# Altium project SAMA7D65-Curiosity.PrjPcb (part 11 of 12)

## Sheet 15 - LED-User-Debug.SchDoc
size B; CompanyName: Microchip Technology Inc.; Organization: Microchip Technology; Address1: 2355 West Chandler Blvd.; Address2: Chandler, AZ  85224; Address4: USA; DocumentNumber: 15; SheetNumber: 15; SheetTotal: 15; SheetTitle: User, Debug Interfaces
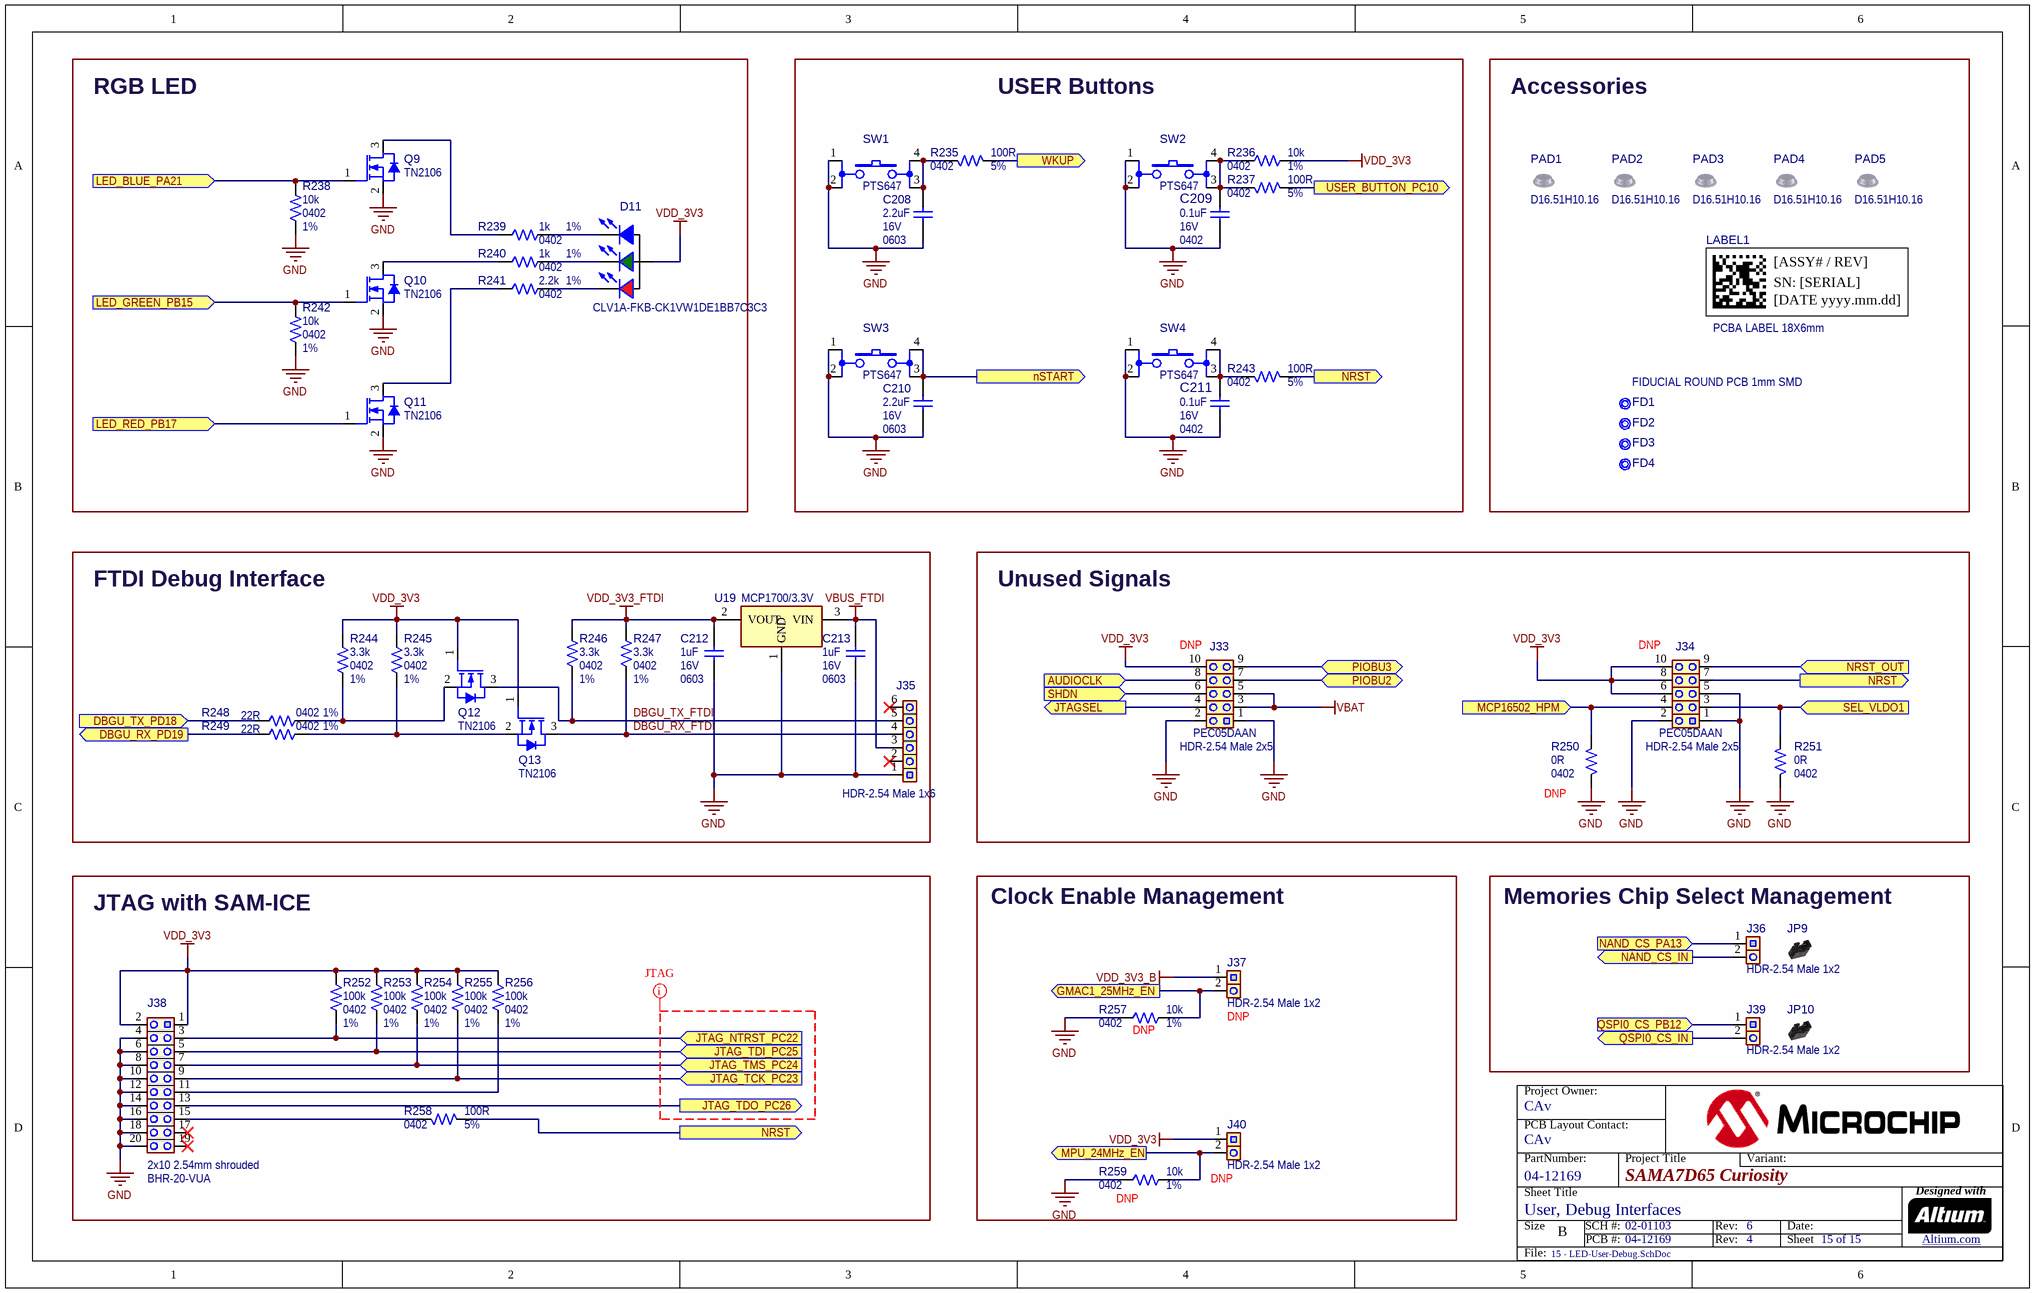
[diagram p14: 15 - LED-User-Debug.SchDoc]

### Parts
C208  value 2.2uF  Voltage: 16V  Package: 0603  [CAP_C_0603]  (hidden comment: Capacitor NP)
C209  value 0.1uF  Voltage: 16V  Package: 0402  [CAP_C_0402]  (hidden comment: Capacitor NP)
C210  value 2.2uF  Voltage: 16V  Package: 0603  [CAP_C_0603]  (hidden comment: Capacitor NP)
C211  value 0.1uF  Voltage: 16V  Package: 0402  [CAP_C_0402]  (hidden comment: Capacitor NP)
C212  value 1uF  Voltage: 16V  Package: 0603  [CAP_C_0603]  (hidden comment: Capacitor NP)
C213  value 1uF  Voltage: 16V  Package: 0603  [CAP_C_0603]  (hidden comment: Capacitor NP)
D11  Manufacturer Part Number 1: CLV1A-FKB-CK1VW1DE1BB7C3C3  [PLCC-4_CLV1A-FKB]  (hidden comment: LED_RGB_CLV1A)
FD1  Description_: FIDUCIAL ROUND PCB 1mm SMD  [Fiducial_1mm]  (hidden comment: FIDUCIAL ROUND)  (no BOM)
FD2  FIDUCIAL ROUND  [Fiducial_1mm]  (value not drawn)  (no BOM)
FD3  FIDUCIAL ROUND  [Fiducial_1mm]  (value not drawn)  (no BOM)
FD4  FIDUCIAL ROUND  [Fiducial_1mm]  (value not drawn)  (no BOM)
J33  value HDR-2.54 Male 2x5  Manufacturer Part Number 1: PEC05DAAN  Populated: DNP  [HDR_M_2.54_2x5]  (hidden comment: Header 2x5)
J34  value HDR-2.54 Male 2x5  Manufacturer Part Number 1: PEC05DAAN  Populated: DNP  [HDR_M_2.54_2x5]  (hidden comment: Header 2x5)
J35  value HDR-2.54 Male 1x6  [HDR_M_2.54_1x6]  (hidden comment: Header 1x6)
J36  value HDR-2.54 Male 1x2  [HDR_M_2.54_1x2]  (hidden comment: Header 1x2)
J37  value HDR-2.54 Male 1x2  Populated: DNP  [HDR_M_2.54_1x2]  (hidden comment: Header 1x2)
J38  value 2x10 2.54mm shrouded  Manufacturer Part Number 1: BHR-20-VUA  [HDR_M_2.54_2X10_SBH11-PBPC-D10-ST-BK]  (hidden comment: Header 2x10)
J39  value HDR-2.54 Male 1x2  [HDR_M_2.54_1x2]  (hidden comment: Header 1x2)
J40  value HDR-2.54 Male 1x2  Populated: DNP  [HDR_M_2.54_1x2]  (hidden comment: Header 1x2)
JP9  Jumper Mechanical  [Jumper_Mechanical]  (value not drawn)  (mechanical)
JP10  Jumper Mechanical  [Jumper_Mechanical]  (value not drawn)  (mechanical)
LABEL1  value PCBA LABEL 18X6mm  [08-10015]  (hidden comment: 08-10015)
PAD1  value D16.51H10.16  [BUMP_BUMPERSPECIALTIES_BS11BL04X08RP_CYLINDRICAL_BLACK_D16.51H10.16]  (hidden comment: Rubber Pad Cylindrical Taper)
PAD2  value D16.51H10.16  [BUMP_BUMPERSPECIALTIES_BS11BL04X08RP_CYLINDRICAL_BLACK_D16.51H10.16]  (hidden comment: Rubber Pad Cylindrical Taper)
PAD3  value D16.51H10.16  [BUMP_BUMPERSPECIALTIES_BS11BL04X08RP_CYLINDRICAL_BLACK_D16.51H10.16]  (hidden comment: Rubber Pad Cylindrical Taper)
PAD4  value D16.51H10.16  [BUMP_BUMPERSPECIALTIES_BS11BL04X08RP_CYLINDRICAL_BLACK_D16.51H10.16]  (hidden comment: Rubber Pad Cylindrical Taper)
PAD5  value D16.51H10.16  [BUMP_BUMPERSPECIALTIES_BS11BL04X08RP_CYLINDRICAL_BLACK_D16.51H10.16]  (hidden comment: Rubber Pad Cylindrical Taper)
Q9  value TN2106  [SOT-23-3]  (hidden comment: Transistor MOS-N GSD)
Q10  value TN2106  [SOT-23-3]  (hidden comment: Transistor MOS-N GSD)
Q11  value TN2106  [SOT-23-3]  (hidden comment: Transistor MOS-N GSD)
Q12  value TN2106  [SOT-23-3]  (hidden comment: Transistor MOS-N GSD)
Q13  value TN2106  [SOT-23-3]  (hidden comment: Transistor MOS-N GSD)
R235  value 100R  Package: 0402  Tolerance: 5%  [RES_C_0402]  (hidden comment: Resistor)
R236  value 10k  Package: 0402  Tolerance: 1%  [RES_C_0402]  (hidden comment: Resistor)
R237  value 100R  Package: 0402  Tolerance: 5%  [RES_C_0402]  (hidden comment: Resistor)
R238  value 10k  Package: 0402  Tolerance: 1%  [RES_C_0402]  (hidden comment: Resistor)
R239  value 1k  Package: 0402  Tolerance: 1%  [RES_C_0402]  (hidden comment: Resistor)
R240  value 1k  Package: 0402  Tolerance: 1%  [RES_C_0402]  (hidden comment: Resistor)
R241  value 2.2k  Package: 0402  Tolerance: 1%  [RES_C_0402]  (hidden comment: Resistor)
R242  value 10k  Package: 0402  Tolerance: 1%  [RES_C_0402]  (hidden comment: Resistor)
R243  value 100R  Package: 0402  Tolerance: 5%  [RES_C_0402]  (hidden comment: Resistor)
R244  value 3.3k  Package: 0402  Tolerance: 1%  [RES_C_0402]  (hidden comment: Resistor)
R245  value 3.3k  Package: 0402  Tolerance: 1%  [RES_C_0402]  (hidden comment: Resistor)
R246  value 3.3k  Package: 0402  Tolerance: 1%  [RES_C_0402]  (hidden comment: Resistor)
R247  value 3.3k  Package: 0402  Tolerance: 1%  [RES_C_0402]  (hidden comment: Resistor)
R248  value 22R  Package: 0402  Tolerance: 1%  [RES_C_0402]  (hidden comment: Resistor)
R249  value 22R  Package: 0402  Tolerance: 1%  [RES_C_0402]  (hidden comment: Resistor)
R250  value 0R  Package: 0402  Populated: DNP  [RES_C_0402]  (hidden comment: Resistor)
R251  value 0R  Package: 0402  [RES_C_0402]  (hidden comment: Resistor)
R252  value 100k  Package: 0402  Tolerance: 1%  [RES_C_0402]  (hidden comment: Resistor)
R253  value 100k  Package: 0402  Tolerance: 1%  [RES_C_0402]  (hidden comment: Resistor)
R254  value 100k  Package: 0402  Tolerance: 1%  [RES_C_0402]  (hidden comment: Resistor)
R255  value 100k  Package: 0402  Tolerance: 1%  [RES_C_0402]  (hidden comment: Resistor)
R256  value 100k  Package: 0402  Tolerance: 1%  [RES_C_0402]  (hidden comment: Resistor)
R257  value 10k  Package: 0402  Tolerance: 1%  Populated: DNP  [RES_C_0402]  (hidden comment: Resistor)
R258  value 100R  Package: 0402  Tolerance: 5%  [RES_C_0402]  (hidden comment: Resistor)
R259  value 10k  Package: 0402  Tolerance: 1%  Populated: DNP  [RES_C_0402]  (hidden comment: Resistor)
SW1  value PTS647  [SW_SMD_4.5mmX4.5mm_PTS647]  (hidden comment: Switch 4 Pin)
SW2  value PTS647  [SW_SMD_4.5mmX4.5mm_PTS647]  (hidden comment: Switch 4 Pin)
SW3  value PTS647  [SW_SMD_4.5mmX4.5mm_PTS647]  (hidden comment: Switch 4 Pin)
SW4  value PTS647  [SW_SMD_4.5mmX4.5mm_PTS647]  (hidden comment: Switch 4 Pin)
U19  value MCP1700/3.3V  [SOT-23-3]  (hidden comment: MCP170X SOT-23-3_SOT-23A-3)

### Blocks framed on the sheet
RGB LED: D11 Q9-Q11 R238-R242
USER Buttons: C208-C211 R235-R237 R243 SW1-SW4
Accessories: FD1-FD4 LABEL1 PAD1-PAD5
FTDI Debug Interface: C212 C213 J35 Q12 Q13 R244-R249 U19
Unused Signals: J33 J34 R250 R251
JTAG with SAM-ICE: J38 R252-R256 R258
Clock Enable Management: J37 J40 R257 R259
Memories Chip Select Management: J36 J39 JP9 JP10

### Ports
AUDIOCLK (in), DBGU_RX_PD19 (out), DBGU_TX_PD18 (in), GMAC1_25MHz_EN (out), JTAG_NTRST_PC22 (in), JTAG_TCK_PC23 (in), JTAG_TDI_PC25 (in), JTAG_TDO_PC26 (out), JTAG_TMS_PC24 (in), JTAGSEL (out), LED_BLUE_PA21 (in), LED_GREEN_PB15 (in), LED_RED_PB17 (in), MCP16502_HPM (in), MPU_24MHz_EN (out), NAND_CS_IN (out), NAND_CS_PA13 (in), NRST (out), NRST_OUT (in), nSTART (out), PIOBU2 (bidir), PIOBU3 (bidir), QSPI0_CS_IN (out), QSPI0_CS_PB12 (in), SEL_VLDO1 (in), SHDN (in), USER_BUTTON_PC10 (out), WKUP (out)

### Nets
GND: C208.1 C209.1 C210.1 C211.1 C212.1 C213.1 J33.1 J33.2 J34.1 J34.2 J34.5 J35.1 J38.4 J38.6 J38.8 J38.10 J38.12 J38.14 J38.16 J38.18 J38.20 Q9.2(S) Q10.2(S) Q11.2(S) R238.2 R242.2 R250.1 R251.1 R257.2 R259.2 SW1.1 SW1.2 SW2.1 SW2.2 SW3.1 SW3.2 SW4.1 SW4.2 U19.1(GND)
VBAT: J33.3 J33.5
VBUS_FTDI: C213.2 J35.3 U19.3(VIN)
VDD_3V3: D11.2(A) J33.10 J34.6 J34.8 J34.10 J38.1 J38.2 J40.1 Q12.1(G) Q13.1(G) R236.2 R244.2 R245.2 R252.2 R253.2 R254.2 R255.2 R256.2
VDD_3V3_B: J37.1
VDD_3V3_FTDI: C212.2 R246.2 R247.2 U19.2(VOUT)
AUDIOCLK: J33.8 ; port AUDIOCLK
DBGU_RX_FTDI: J35.4 Q13.3(D) R247.1
DBGU_RX_PD19: R249.1 ; port DBGU_RX_PD19
DBGU_TX_FTDI: J35.5 Q12.3(D) R246.1
DBGU_TX_PD18: R248.1 ; port DBGU_TX_PD18
GMAC1_25MHz_EN: J37.2 R257.1 ; port GMAC1_25MHz_EN
JTAG_NTRST_PC22: J38.3 R252.1 ; port JTAG_NTRST_PC22
JTAG_TCK_PC23: J38.9 R255.1 ; port JTAG_TCK_PC23
JTAG_TDI_PC25: J38.5 R253.1 ; port JTAG_TDI_PC25
JTAG_TDO_PC26: J38.13 ; port JTAG_TDO_PC26
JTAG_TMS_PC24: J38.7 R254.1 ; port JTAG_TMS_PC24
JTAGSEL: J33.4 ; port JTAGSEL
LED_BLUE_PA21: Q9.1(G) R238.1 ; port LED_BLUE_PA21
LED_GREEN_PB15: Q10.1(G) R242.1 ; port LED_GREEN_PB15
LED_RED_PB17: Q11.1(G) ; port LED_RED_PB17
MCP16502_HPM: J34.4 R250.2 ; port MCP16502_HPM
MPU_24MHz_EN: J40.2 R259.1 ; port MPU_24MHz_EN
NAND_CS_IN: J36.2 ; port NAND_CS_IN
NAND_CS_PA13: J36.1 ; port NAND_CS_PA13
NRST: J34.7 R243.2 R258.2 ; port NRST
nRST_OUT: J34.9 ; port NRST_OUT
nSTART: C210.2 SW3.3 SW3.4 ; port nSTART
PIOBU2: J33.7 ; port PIOBU2
PIOBU3: J33.9 ; port PIOBU3
QSPI0_CS_IN: J39.2 ; port QSPI0_CS_IN
QSPI0_CS_PB12: J39.1 ; port QSPI0_CS_PB12
SEL_VLDO1: J34.3 R251.2 ; port SEL_VLDO1
SHDN: J33.6 ; port SHDN
USER_BUTTON_PC10: R237.2 ; port USER_BUTTON_PC10
WKUP: R235.2 ; port WKUP
NetC208_2: C208.2 R235.1 SW1.3 SW1.4
NetC209_2: C209.2 R236.1 R237.1 SW2.3 SW2.4
NetC211_2: C211.2 R243.1 SW4.3 SW4.4
NetD11_1: D11.1(Kr) R241.2
NetD11_3: D11.3(Kb) R239.2
NetD11_4: D11.4(Kg) R240.2
NetJ38_11: J38.11 R256.1
NetJ38_15: J38.15 R258.1
NetQ9_3: Q9.3(D) R239.1
NetQ10_3: Q10.3(D) R240.1
NetQ11_3: Q11.3(D) R241.1
NetQ12_2: Q12.2(S) R244.1 R248.2
NetQ13_2: Q13.2(S) R245.1 R249.2

Not connected (* = marked no-connect by the designer): FD1 1; FD2 1; FD3 1; FD4 1; J35 2* 6*; J38 17* 19*

### Layout directives
net class JTAG; rule Matched Net Lengths [Tolerance = 2mm]: (no net found under the mark)

### Notes on the sheet
- Project Owner:
- PCB Layout Contact:
- PartNumber:
- Project Title
- Variant:
- Sheet Title
- Size
- B
- SCH #:
- PCB #:
- Rev:
- Date:
- Sheet
- Designed with
- Altium.com <http://go.altium.com/MicrochipLandingPage_Evaluation.html>
- File:
- (in symbol 08-10015) [ASSY# / REV]; SN: [SERIAL]; [DATE yyyy.mm.dd]

### Library data of the parts
C208 C210 = CAP0597: Manufacturer 1: TDK Corporation; Manufacturer Part Number 1: C1608X5R1C225K080AB; Description_: CAP CER 2.2uF 16V 10% X5R SMD 0603; Dev Tools Status: Production; Tolerance: 10%; Temperature Coefficient: X5R; Type: Ceramic; Populated: Yes; MCHP-ID: CAP0597; Revision: 6; Symbol: Capacitor NP; Status: MCL Design; ComponentLink1URL: https://chn-vm-apps.microchip.com/mchprepo/parts/Datasheets/general_B11.pdf; ComponentLink1Description: SVN Datasheet; ComponentLink2URL: C:\ALTIUM_WORK\00001_MCHP-CDB\Datasheets\general_B11.pdf; ComponentLink2Description: Local Datasheet; ComponentLink3URL: C:\ALTIUM_WORK\00001_MCHP-CDB\Library\LibraryRefs\Capacitor NP.SchLib; ComponentLink3Description: Open Symbol; ComponentLink4URL: C:\ALTIUM_WORK\00001_MCHP-CDB\Library\Footprints\CAP_C_0603.PcbLib; ComponentLink4Description: Open Footprint; ComponentLink5Description: Open Footprint 2; ComponentLink6Description: Open Footprint 3; ComponentLink7Description: Open Footprint 4; Operating Temperature: -55C to +85C; Category: Capacitor; Supplier 1: Digi-Key; Supplier Part Number 1: 445-5157-1-ND; Quantity Override: 1
C209 C211 = CAP1033: as C178 on sheet 13 - USB; MCHP-ID: CAP1033; Revision: 10; Symbol: Capacitor NP; Status: MCL Design; ComponentLink1URL: https://chn-vm-apps.microchip.com/mchprepo/parts/Datasheets/L0005E.pdf; ComponentLink1Description: SVN Datasheet; ComponentLink2URL: C:\ALTIUM_WORK\00001_MCHP-CDB\Datasheets\L0005E.pdf; ComponentLink2Description: Local Datasheet; ComponentLink3URL: C:\ALTIUM_WORK\00001_MCHP-CDB\Library\LibraryRefs\Capacitor NP.SchLib; ComponentLink3Description: Open Symbol; ComponentLink4URL: C:\ALTIUM_WORK\00001_MCHP-CDB\Library\Footprints\CAP_C_0402.PcbLib; ComponentLink4Description: Open Footprint; ComponentLink5Description: Open Footprint 2; ComponentLink6Description: Open Footprint 3; ComponentLink7Description: Open Footprint 4; Operating Temperature: -55C to +125C; Category: Capacitor; Manufacturer 2: KEMET; Manufacturer Part Number 2: C0402C104K4RAC7867; Manufacturer 3: Samsung Electro-Mechanics; Manufacturer Part Number 3: CL05B104KO5NNNC; Supplier 1: Hottech; Supplier Part Number 1: C1005B104K160NT; Supplier 2: Digi-Key; Supplier Part Number 2: 399-C0402C104K4RAC7867TR-ND; Supplier 3: Digi-Key; Supplier Part Number 3: 1276-1001-1-ND; Quantity Override: 1; Manufacturer 4: Würth Elektronik; Manufacturer Part Number 4: 885012205037; Manufacturer 5: Samsung Electro-Mechanics; Manufacturer Part Number 5: CL05B104KO5NNND; Manufacturer 6: Samsung Electro-Mechanics; Manufacturer Part Number 6: CL05B104KO5NNNO; Manufacturer 7: Yageo; Manufacturer Part Number 7: CC0402KRX7R7BB104; Supplier 4: Digi-Key; Supplier Part Number 4: 732-7532-1-ND; Supplier 5: Mouser; Supplier Part Number 5: 187-CL05B104KO5NNND; Supplier 6: Samsung Electro-Mechanics; Supplier Part Number 6: CL05B104KO5NNNO; Supplier 7: Yageo; Supplier Part Number 7: CC0402KRX7R7BB104
C212 C213 = CAP0265: as C188 on sheet 14 - mBUS-CAN; MCHP-ID: CAP0265; Revision: 4; Symbol: Capacitor NP; Status: MCL Design; ComponentLink1URL: https://chn-vm-apps.microchip.com/mchprepo/parts/Datasheets/smccp.pdf; ComponentLink1Description: SVN Datasheet; ComponentLink2URL: C:\ALTIUM_WORK\00001_MCHP-CDB\Datasheets\smccp.pdf; ComponentLink2Description: Local Datasheet; ComponentLink3URL: C:\ALTIUM_WORK\00001_MCHP-CDB\Library\LibraryRefs\Capacitor NP.SchLib; ComponentLink3Description: Open Symbol; ComponentLink4URL: C:\ALTIUM_WORK\00001_MCHP-CDB\Library\Footprints\CAP_C_0603.PcbLib; ComponentLink4Description: Open Footprint; ComponentLink5Description: Open Footprint 2; ComponentLink6Description: Open Footprint 3; ComponentLink7Description: Open Footprint 4; Operating Temperature: -55C to +85C; Category: Capacitor; Manufacturer 2: KEMET; Manufacturer Part Number 2: C0603C105K4PACTU; Manufacturer 3: TDK; Manufacturer Part Number 3: C1608X5R1C105K080AA; Manufacturer 4: Vishay Vitramon; Manufacturer Part Number 4: VJ0603G105KXJCW1BC; Manufacturer 5: Yageo; Manufacturer Part Number 5: CC0603KRX5R7BB105; Supplier 1: Digi-Key; Supplier Part Number 1: 478-1249-1-ND; Supplier 2: Digi-Key; Supplier Part Number 2: 399-5090-1-ND; Supplier 3: Digi-Key; Supplier Part Number 3: 445-1416-1-ND; Supplier 4: Digi-Key; Supplier Part Number 4: 720-1851-1-ND; Supplier 5: Digi-Key; Supplier Part Number 5: 311-1444-1-ND; Quantity Override: 1
D11 = DIODE1214: Manufacturer 1: Cree Inc.; Value: RED, GREEN, BLUE; Description_: DIO LED TRI RED, GREEN, BLUE 2V, 3.2V, 3.2V 20mA, 20mA, 20mA SMD 4-PLCC; Dev Tools Status: Production; Type: LED Tricolor; Forward Current: 20mA, 20mA, 20mA; Power: 130mW, 100mW, 100mW; Reverse Current: 10uA; Reverse Voltage: 5V; Owner: Randolph Sobrepena; Populated: YES; MCHP-ID: DIODE1214; Revision: 2; Symbol: LED_RGB_CLV1A; Status: MCL Design; Package: 4-PLCC; ComponentLink1URL: https://chn-vm-apps.microchip.com/mchprepo/parts/Datasheets/CLV1A-FKB_Rev5; ComponentLink1Description: SVN Datasheet; ComponentLink2URL: C:\ALTIUM_WORK\00001_MCHP-CDB\Datasheets\CLV1A-FKB_Rev5; ComponentLink2Description: Local Datasheet; ComponentLink3URL: C:\ALTIUM_WORK\00001_MCHP-CDB\Library\LibraryRefs\LED_RGB_CLV1A.SchLib; ComponentLink3Description: Open Symbol; ComponentLink4URL: C:\ALTIUM_WORK\00001_MCHP-CDB\Library\Footprints\PLCC-4_CLV1A-FKB.PcbLib; ComponentLink4Description: Open Footprint; ComponentLink5Description: Open Footprint 2; ComponentLink6Description: Open Footprint 3; ComponentLink7Description: Open Footprint 4; Operating Temperature: -40C - +100C; Category: Diode; Supplier 1: Digi-Key; Supplier Part Number 1: CLV1A-FKB-CK1VW1DE1BB7C3C3CT-ND; Quantity Override: 1
FD1 = MECH0282: Fiducial; Dev Tools Status: Design; Owner: Dragos Danaila; Populated: MECH; MCHP-ID: MECH0282; Value: Fiducial; Revision: A; Symbol: FIDUCIAL ROUND; Status: MCL Design; ComponentLink1Description: SVN Datasheet; ComponentLink2Description: Local Datasheet; ComponentLink3URL: C:\ALTIUM_WORK\00001_MCHP-CDB\Library\LibraryRefs\FIDUCIAL ROUND.SchLib; ComponentLink3Description: Open Symbol; ComponentLink4URL: C:\ALTIUM_WORK\00001_MCHP-CDB\Library\Footprints\Fiducial_1mm.PcbLib; ComponentLink4Description: Open Footprint; ComponentLink5Description: Open Footprint 2; ComponentLink6Description: Open Footprint 3; ComponentLink7Description: Open Footprint 4; Type: Fiducial; Category: Hardware; Quantity Override: 1
FD2-FD4 = MECH0282: Fiducial; Description_: FIDUCIAL ROUND PCB 1mm SMD; Dev Tools Status: Design; Owner: Dragos Danaila; Populated: MECH; MCHP-ID: MECH0282; Value: Fiducial; Revision: A; Symbol: FIDUCIAL ROUND; Status: MCL Design; ComponentLink1Description: SVN Datasheet; ComponentLink2Description: Local Datasheet; ComponentLink3URL: C:\ALTIUM_WORK\00001_MCHP-CDB\Library\LibraryRefs\FIDUCIAL ROUND.SchLib; ComponentLink3Description: Open Symbol; ComponentLink4URL: C:\ALTIUM_WORK\00001_MCHP-CDB\Library\Footprints\Fiducial_1mm.PcbLib; ComponentLink4Description: Open Footprint; ComponentLink5Description: Open Footprint 2; ComponentLink6Description: Open Footprint 3; ComponentLink7Description: Open Footprint 4; Type: Fiducial; Category: Hardware; Quantity Override: 1
J33 J34 = CON0441: Manufacturer 1: Sullins; Description_: CON HDR-2.54 Male 2x5 Tin 5.84MH TH VERT; Dev Tools Status: Production; Owner: Mike Sullivan (Arena); Current: 3A; MCHP-ID: CON0441; Revision: 1; Symbol: Header 2x5; Status: MCL Design; ComponentLink1URL: https://chn-vm-apps.microchip.com/mchprepo/parts/Datasheets/97_Page78-79_HEADER_.100_2.54mm_MALE_BREAKAWAY.pdf; ComponentLink1Description: SVN Datasheet; ComponentLink2URL: C:\ALTIUM_WORK\00001_MCHP-CDB\Datasheets\97_Page78-79_HEADER_.100_2.54mm_MALE_BREAKAWAY.pdf; ComponentLink2Description: Local Datasheet; ComponentLink3URL: C:\ALTIUM_WORK\00001_MCHP-CDB\Library\LibraryRefs\Header 2x5.SchLib; ComponentLink3Description: Open Symbol; ComponentLink4URL: C:\ALTIUM_WORK\00001_MCHP-CDB\Library\Footprints\HDR_M_2.54_2x5.PcbLib; ComponentLink4Description: Open Footprint; ComponentLink5Description: Open Footprint 2; ComponentLink6Description: Open Footprint 3; ComponentLink7Description: Open Footprint 4; Type: Header 2.54mm; Category: Connector; Manufacturer 2: SHENZHEN JUNHAO ENGINEERING; Manufacturer Part Number 2: R-213-1011-0021-400; Supplier 1: Digi-Key; Supplier Part Number 1: S2012E-05-ND; Supplier 2: Raynen; Supplier Part Number 2: CONN00288C01M; Quantity Override: 1
J35 = CON1106: Manufacturer 1: FCI; Manufacturer Part Number 1: 68001-106HLF; Description_: CON HDR-2.54 Male 1x6 Gold 5.84MH TH VERT; Dev Tools Status: Production; Owner: Bogdan P (M91398); Populated: Yes; MCHP-ID: CON1106; Revision: 2; Symbol: Header 1x6; Status: MCL Design; ComponentLink1URL: https://chn-vm-apps.microchip.com/mchprepo/parts/Datasheets/68000.pdf; ComponentLink1Description: SVN Datasheet; ComponentLink2URL: C:\ALTIUM_WORK\00001_MCHP-CDB\Datasheets\68000.pdf; ComponentLink2Description: Local Datasheet; ComponentLink3URL: C:\ALTIUM_WORK\00001_MCHP-CDB\Library\LibraryRefs\Header 1x6.SchLib; ComponentLink3Description: Open Symbol; ComponentLink4URL: C:\ALTIUM_WORK\00001_MCHP-CDB\Library\Footprints\HDR_M_2.54_1x6.PcbLib; ComponentLink4Description: Open Footprint; ComponentLink5Description: Open Footprint 2; ComponentLink6Description: Open Footprint 3; ComponentLink7Description: Open Footprint 4; Type: Header 2.54mm; Category: Connector; Supplier 1: Digi-Key; Supplier Part Number 1: 609-3272-ND; Quantity Override: 1; Manufacturer 2: FCI; Manufacturer Part Number 2: 68000-106HLF; Manufacturer 3: Samtec Inc; Manufacturer Part Number 3: TSW-106-07-G-S; Manufacturer 4: FCI; Manufacturer Part Number 4: 68000-236HLF; Manufacturer 5: SHENZHEN JUNHAO ENGINEERING; Manufacturer Part Number 5: R-211-0611-0021-400; Supplier 2: Digi-Key; Supplier Part Number 2: 609-3249-ND; Supplier 3: Digi-Key; Supplier Part Number 3: SAM1029-06-ND; Supplier 4: FCI; Supplier Part Number 4: 68000-236HLF; Supplier 5: SHENZHEN JUNHAO ENGINEERING; Supplier Part Number 5: R-211-0611-0021-400
J36 J39 = CON1632: Manufacturer 1: Würth Elektronik; Manufacturer Part Number 1: 61300211121; Description_: CON HDR-2.54 Male 1x2 Gold 5.84MH TH VERT; Dev Tools Status: Production; Owner: Narasimha Murthy; Populated: YES; Voltage: 250V; Current: 3A; MCHP-ID: CON1632; Revision: 3; Symbol: Header 1x2; Status: MCL Design; ComponentLink1URL: https://chn-vm-apps.microchip.com/mchprepo/parts/Datasheets/6130xx11121.pdf; ComponentLink1Description: SVN Datasheet; ComponentLink2URL: C:\ALTIUM_WORK\00001_MCHP-CDB\Datasheets\6130xx11121.pdf; ComponentLink2Description: Local Datasheet; ComponentLink3URL: C:\ALTIUM_WORK\00001_MCHP-CDB\Library\LibraryRefs\Header 1x2.SchLib; ComponentLink3Description: Open Symbol; ComponentLink4URL: C:\ALTIUM_WORK\00001_MCHP-CDB\Library\Footprints\HDR_M_2.54_1x2.PcbLib; ComponentLink4Description: Open Footprint; ComponentLink5Description: Open Footprint 2; ComponentLink6Description: Open Footprint 3; ComponentLink7Description: Open Footprint 4; Type: Header 2.54mm; Category: Connector; Supplier 1: Digi-Key; Supplier Part Number 1: 732-5315-ND; Quantity Override: 1; Manufacturer 2: SHENZHEN JUNHAO ENGINEERING; Manufacturer Part Number 2: R-211-0211-0021-000; Supplier 2: SHENZHEN JUNHAO ENGINEERING; Supplier Part Number 2: R-211-0211-0021-000; Assembly Type: TH
J37 J40 = CON1632: Manufacturer 1: Würth Elektronik; Manufacturer Part Number 1: 61300211121; Description_: CON HDR-2.54 Male 1x2 Gold 5.84MH TH VERT; Dev Tools Status: Production; Owner: Narasimha Murthy; Voltage: 250V; Current: 3A; MCHP-ID: CON1632; Revision: 3; Symbol: Header 1x2; Status: MCL Design; ComponentLink1URL: https://chn-vm-apps.microchip.com/mchprepo/parts/Datasheets/6130xx11121.pdf; ComponentLink1Description: SVN Datasheet; ComponentLink2URL: C:\ALTIUM_WORK\00001_MCHP-CDB\Datasheets\6130xx11121.pdf; ComponentLink2Description: Local Datasheet; ComponentLink3URL: C:\ALTIUM_WORK\00001_MCHP-CDB\Library\LibraryRefs\Header 1x2.SchLib; ComponentLink3Description: Open Symbol; ComponentLink4URL: C:\ALTIUM_WORK\00001_MCHP-CDB\Library\Footprints\HDR_M_2.54_1x2.PcbLib; ComponentLink4Description: Open Footprint; ComponentLink5Description: Open Footprint 2; ComponentLink6Description: Open Footprint 3; ComponentLink7Description: Open Footprint 4; Type: Header 2.54mm; Category: Connector; Supplier 1: Digi-Key; Supplier Part Number 1: 732-5315-ND; Quantity Override: 1; Manufacturer 2: SHENZHEN JUNHAO ENGINEERING; Manufacturer Part Number 2: R-211-0211-0021-000; Supplier 2: SHENZHEN JUNHAO ENGINEERING; Supplier Part Number 2: R-211-0211-0021-000; Assembly Type: TH
J38 = CON2625: Manufacturer 1: Adam Tech; Description_: CON HDR-2.54 Male 2x10 Gold Shroud 9.1MH TH VERT; Dev Tools Status: Design; Owner: Dragos Danaila; Populated: YES; Voltage: 250VAC; Current: 3A; MCHP-ID: CON2625; Revision: 1; Symbol: Header 2x10; Status: MCL Design; ComponentLink1URL: https://chn-vm-apps.microchip.com/mchprepo/parts/Datasheets/bhr-xx-vua-data-sheet.pdf; ComponentLink1Description: SVN Datasheet; ComponentLink2URL: C:\ALTIUM_WORK\00001_MCHP-CDB\Datasheets\bhr-xx-vua-data-sheet.pdf; ComponentLink2Description: Local Datasheet; ComponentLink3URL: C:\ALTIUM_WORK\00001_MCHP-CDB\Library\LibraryRefs\Header 2x10.SchLib; ComponentLink3Description: Open Symbol; ComponentLink4URL: C:\ALTIUM_WORK\00001_MCHP-CDB\Library\Footprints\HDR_M_2.54_2X10_SBH11-PBPC-D10-ST-BK.PcbLib; ComponentLink4Description: Open Footprint; ComponentLink5Description: Open Footprint 2; ComponentLink6Description: Open Footprint 3; ComponentLink7Description: Open Footprint 4; Type: Header 2.54mm; Category: Connector; Supplier 1: Digi-Key; Supplier Part Number 1: 2057-BHR-20-VUA-ND; Quantity Override: 1; Operating Temperature: -50C to +105C; Assembly Type: TH
JP9 JP10 = MECH0174: as JP6-JP8 on sheet 14 - mBUS-CAN; MCHP-ID: MECH0174; Revision: 1; Symbol: Jumper Mechanical; Status: MCL Design; ComponentLink1URL: https://chn-vm-apps.microchip.com/mchprepo/parts/Datasheets/60900213421.pdf; ComponentLink1Description: SVN Datasheet; ComponentLink2URL: C:\ALTIUM_WORK\00001_MCHP-CDB\Datasheets\60900213421.pdf; ComponentLink2Description: Local Datasheet; ComponentLink3URL: C:\ALTIUM_WORK\00001_MCHP-CDB\Library\LibraryRefs\Jumper Mechanical.SchLib; ComponentLink3Description: Open Symbol; ComponentLink4URL: C:\ALTIUM_WORK\00001_MCHP-CDB\Library\Footprints\Jumper_Mechanical.PcbLib; ComponentLink4Description: Open Footprint; ComponentLink5Description: Open Footprint 2; ComponentLink6Description: Open Footprint 3; ComponentLink7Description: Open Footprint 4; Type: Jumper; Category: Hardware; Supplier 1: Digi-Key; Supplier Part Number 1: 732-2678-ND; Quantity Override: 1
LABEL1 = 08-10015: Manufacturer 1: ACT Logimark AS; Manufacturer Part Number 1: 505462; Description_: LABEL PCBA 18x6mm Datamatrix Assy# / Rev / Serial / Date; Dev Tools Status: Production; Populated: MECH; Owner: Mark Loper; MCHP-ID: 08-10015; Revision: 4; Symbol: 08-10015; Status: MCL Design; ComponentLink1Description: SVN Datasheet; ComponentLink2Description: Local Datasheet; ComponentLink3URL: C:\ALTIUM_WORK\00001_MCHP-CDB\Library\LibraryRefs\08-10015.SchLib; ComponentLink3Description: Open Symbol; ComponentLink4URL: C:\ALTIUM_WORK\00001_MCHP-CDB\Library\Footprints\08-10015.PcbLib; ComponentLink4Description: Open Footprint; ComponentLink5Description: Open Footprint 2; ComponentLink6Description: Open Footprint 3; ComponentLink7Description: Open Footprint 4; Type: PCBA Label; Category: MCHP-Manufacturing; Quantity Override: 1; Manufacturer 2: Sunrise Paper (M) Sdn Bhd; Manufacturer Part Number 2: 037268-5; Manufacturer 3: Raynen; Manufacturer Part Number 3: 10010407; Supplier 1: ACT Logimark AS; Supplier Part Number 1: 505462; Supplier 2: Microchip Technology; Supplier Part Number 2: 01000-004967; Supplier 3: Raynen; Supplier Part Number 3: 10010407
PAD1-PAD5 = MECH0274: Manufacturer 1: Bumper Specialties Inc.; Manufacturer Part Number 1: BS11BL04X08RP; Description_: MECH HW RUBBER PAD Cylindrical flat top D16.51H10.16 Black; Dev Tools Status: Production; Owner: Dragos Danaila; Populated: MECH; MCHP-ID: MECH0274; Revision: 1; Symbol: Rubber Pad Cylindrical Taper; Status: MCL Design; ComponentLink1URL: https://chn-vm-apps.microchip.com/mchprepo/parts/Datasheets/Bumper-Technical-Drawing-BS11.pdf; ComponentLink1Description: SVN Datasheet; ComponentLink2URL: C:\ALTIUM_WORK\00001_MCHP-CDB\Datasheets\Bumper-Technical-Drawing-BS11.pdf; ComponentLink2Description: Local Datasheet; ComponentLink3URL: C:\ALTIUM_WORK\00001_MCHP-CDB\Library\LibraryRefs\Rubber Pad Cylindrical Taper.SchLib; ComponentLink3Description: Open Symbol; ComponentLink4URL: C:\ALTIUM_WORK\00001_MCHP-CDB\Library\Footprints\BUMP_BUMPERSPECIALTIES_BS11BL04X08RP_CYLINDRICAL_BLACK_D16.51H10.16.PcbLib; ComponentLink4Description: Open Footprint; ComponentLink5Description: Open Footprint 2; ComponentLink6Description: Open Footprint 3; ComponentLink7Description: Open Footprint 4; Type: Rubber Pad; Category: Hardware; Supplier 1: Digi-Key; Supplier Part Number 1: 2042-1031-ND; Quantity Override: 1
Q9-Q13 = MIC7420: Transistor MOS; Manufacturer 1: Microchip Technology; Manufacturer Part Number 1: TN2106K1-G; Description_: MCHP ANALOG MOSFET N-CH TN2106 60V 280mA 360mW 2.5R SOT23-3; Type: MOSFET; Dev Tools Status: Production; Owner: Ilie Galan; Populated: YES; MCHP-ID: MIC7420; Symbol: Transistor MOS-N GSD; Status: MCL Design; Revision: 1; Category: MCHP-Analog; ComponentLink1Description: SVN Datasheet; ComponentLink2URL: C:\ALTIUM_WORK\00001_MCHP-CDB\Datasheets\TN2106 B080913.pdf; ComponentLink2Description: Local Datasheet; ComponentLink3URL: C:\ALTIUM_WORK\00001_MCHP-CDB\Library\LibraryRefs\Transistor MOS-N GSD.SchLib; ComponentLink3Description: Open Symbol; ComponentLink4URL: C:\ALTIUM_WORK\00001_MCHP-CDB\Library\Footprints\SOT-23-3.PcbLib; ComponentLink4Description: Open Footprint; ComponentLink5Description: Open Footprint 2; ComponentLink6Description: Open Footprint 3; ComponentLink7Description: Open Footprint 4; Supplier 1: Microchip Technology; Supplier Part Number 1: TN2106K1-G; Quantity Override: 1
R235 R237 R243 R258 = RES2692: Manufacturer 1: Bourns Inc.; Manufacturer Part Number 1: CR0402AJW-101GAS; Description_: RES TKF 100R 5% 1/10W SMD 0402; Dev Tools Status: Design; Voltage: 50V; Temperature Coeffcient: 200ppm/C; Power: 1/16W; Owner: Dragos Danaila; Populated: YES; MCHP-ID: RES2692; Revision: 1; Symbol: Resistor; Status: MCL Design; ComponentLink1URL: https://chn-vm-apps.microchip.com/mchprepo/parts/Datasheets/crxxxxa-as.pdf; ComponentLink1Description: SVN Datasheet; ComponentLink2URL: C:\ALTIUM_WORK\00001_MCHP-CDB\Datasheets\crxxxxa-as.pdf; ComponentLink2Description: Local Datasheet; ComponentLink3URL: C:\ALTIUM_WORK\00001_MCHP-CDB\Library\LibraryRefs\Resistor.SchLib; ComponentLink3Description: Open Symbol; ComponentLink4URL: C:\ALTIUM_WORK\00001_MCHP-CDB\Library\Footprints\RES_C_0402.PcbLib; ComponentLink4Description: Open Footprint; ComponentLink5Description: Open Footprint 2; ComponentLink6Description: Open Footprint 3; ComponentLink7Description: Open Footprint 4; Operating Temperature: -55C to +155C; Category: Resistor; Type: RES SMD; Composition: TKF; Supplier 1: Digikey; Supplier Part Number 1: CR0402AJW-101GASTR-ND; Quantity Override: 1
R236 R238 R242 = RSMT1019: Manufacturer 1: Panasonic; Manufacturer Part Number 1: ERJ-2RKF1002X; Description_: RES TKF 10k 1% 1/10W SMD 0402; Dev Tools Status: Production; Temperature Coeffcient: 100ppm/C; Power: 1/10W; Owner: Brent Lanphear; Populated: Yes; Voltage: 50V; MCHP-ID: RSMT1019; Revision: 2; Symbol: Resistor; Status: MCL Design; ComponentLink1URL: https://chn-vm-apps.microchip.com/mchprepo/parts/Datasheets/AOA0000CE2.pdf; ComponentLink1Description: SVN Datasheet; ComponentLink2URL: C:\ALTIUM_WORK\00001_MCHP-CDB\Datasheets\AOA0000CE2.pdf; ComponentLink2Description: Local Datasheet; ComponentLink3URL: C:\ALTIUM_WORK\00001_MCHP-CDB\Library\LibraryRefs\Resistor.SchLib; ComponentLink3Description: Open Symbol; ComponentLink4URL: C:\ALTIUM_WORK\00001_MCHP-CDB\Library\Footprints\RES_C_0402.PcbLib; ComponentLink4Description: Open Footprint; ComponentLink5Description: Open Footprint 2; ComponentLink6Description: Open Footprint 3; ComponentLink7Description: Open Footprint 4; Category: Resistor; Type: RES SMD; Composition: TKF; Supplier 1: Digi-Key; Supplier Part Number 1: P10.0KLCT-ND; Quantity Override: 1; Operating Temperature: -55C to +155C
R239 R240 = RES1022: Manufacturer 1: Panasonic; Manufacturer Part Number 1: ERJ-2RKF1001X; Description_: RES TKF 1k 1% 1/10W SMD 0402; Dev Tools Status: Production; Voltage: 50V; Power: 1/10W; Owner: Tad Ahlvers; Populated: YES; Temperature Coefficient: 100ppm/C; MCHP-ID: RES1022; Revision: 3; Symbol: Resistor; Status: MCL Design; ComponentLink1URL: https://chn-vm-apps.microchip.com/mchprepo/parts/Datasheets/AOA0000CE2.pdf; ComponentLink1Description: SVN Datasheet; ComponentLink2URL: C:\ALTIUM_WORK\00001_MCHP-CDB\Datasheets\AOA0000CE2.pdf; ComponentLink2Description: Local Datasheet; ComponentLink3URL: C:\ALTIUM_WORK\00001_MCHP-CDB\Library\LibraryRefs\Resistor.SchLib; ComponentLink3Description: Open Symbol; ComponentLink4URL: C:\ALTIUM_WORK\00001_MCHP-CDB\Library\Footprints\RES_C_0402.PcbLib; ComponentLink4Description: Open Footprint; ComponentLink5Description: Open Footprint 2; ComponentLink6Description: Open Footprint 3; ComponentLink7Description: Open Footprint 4; Operating Temperature: -55C to +155C; Category: Resistor; Type: RES SMD; Composition: TKF; Supplier 1: Digi-Key; Supplier Part Number 1: P1.00KLTR-ND; Quantity Override: 1
R241 = RES1023: Manufacturer 1: Panasonic; Manufacturer Part Number 1: ERJ-2RKF2201X; Description_: RES TKF 2.2k 1% 1/10W SMD 0402; Dev Tools Status: Production; Voltage: 50V; Temperature Coeffcient: 100ppm/C; Power: 1/10W; Owner: Tad Ahlvers; Populated: YES; MCHP-ID: RES1023; Revision: 1; Symbol: Resistor; Status: MCL Design; ComponentLink1URL: https://chn-vm-apps.microchip.com/mchprepo/parts/Datasheets/AOA0000CE2.pdf; ComponentLink1Description: SVN Datasheet; ComponentLink2URL: C:\ALTIUM_WORK\00001_MCHP-CDB\Datasheets\AOA0000CE2.pdf; ComponentLink2Description: Local Datasheet; ComponentLink3URL: C:\ALTIUM_WORK\00001_MCHP-CDB\Library\LibraryRefs\Resistor.SchLib; ComponentLink3Description: Open Symbol; ComponentLink4URL: C:\ALTIUM_WORK\00001_MCHP-CDB\Library\Footprints\RES_C_0402.PcbLib; ComponentLink4Description: Open Footprint; ComponentLink5Description: Open Footprint 2; ComponentLink6Description: Open Footprint 3; ComponentLink7Description: Open Footprint 4; Operating Temperature: -55C to +155C; Category: Resistor; Type: RES SMD; Composition: TKF; Supplier 1: Digi-Key; Supplier Part Number 1: P2.20KLTR-ND; Quantity Override: 1
R244-R247 = RES2130: Manufacturer 1: Panasonic - ECG; Manufacturer Part Number 1: ERJ-2RKF3301X; Description_: RES TKF 3.3k 1% 1/10W SMD 0402; Dev Tools Status: Production; Voltage: 50V; Temperature Coefficient: 100ppm/C; Power: 1/10W; Owner: Mike Ragsdale; Populated: YES; MCHP-ID: RES2130; Revision: 1; Symbol: Resistor; Status: MCL Design; ComponentLink1URL: https://chn-vm-apps.microchip.com/mchprepo/parts/Datasheets/AOA0000C304.pdf; ComponentLink1Description: SVN Datasheet; ComponentLink2URL: C:\ALTIUM_WORK\00001_MCHP-CDB\Datasheets\AOA0000C304.pdf; ComponentLink2Description: Local Datasheet; ComponentLink3URL: C:\ALTIUM_WORK\00001_MCHP-CDB\Library\LibraryRefs\Resistor.SchLib; ComponentLink3Description: Open Symbol; ComponentLink4URL: C:\ALTIUM_WORK\00001_MCHP-CDB\Library\Footprints\RES_C_0402.PcbLib; ComponentLink4Description: Open Footprint; ComponentLink5Description: Open Footprint 2; ComponentLink6Description: Open Footprint 3; ComponentLink7Description: Open Footprint 4; Operating Temperature: -55C to +155C; Category: Resistor; Type: RES SMD; Composition: TKF; Supplier 1: Digi-Key; Supplier Part Number 1: P3.30KLTR-ND; Quantity Override: 1
R248 R249 = RES1474: Manufacturer 1: Panasonic Electronic Components; Manufacturer Part Number 1: ERJ-2RKF22R0X; Description_: RES TKF 22R 1% 1/20W SMD 0402; Dev Tools Status: Production; Temperature Coeffcient: 100ppm/C; Circuit Type: Isolated; Power: 1/10W; Owner: Mike Ragsdale; Populated: YES; MCHP-ID: RES1474; Revision: 1; Symbol: Resistor; Status: MCL Design; ComponentLink1Description: SVN Datasheet; ComponentLink2Description: Local Datasheet; ComponentLink3URL: C:\ALTIUM_WORK\00001_MCHP-CDB\Library\LibraryRefs\Resistor.SchLib; ComponentLink3Description: Open Symbol; ComponentLink4URL: C:\ALTIUM_WORK\00001_MCHP-CDB\Library\Footprints\RES_C_0402.PcbLib; ComponentLink4Description: Open Footprint; ComponentLink5Description: Open Footprint 2; ComponentLink6Description: Open Footprint 3; ComponentLink7Description: Open Footprint 4; Operating Temperature: -55C to +155C; Category: Resistor; Type: RES SMD; Composition: TKF; Supplier 1: Digi-Key; Supplier Part Number 1: P22.0LCT-ND; Quantity Override: 1
R250 = RSMT1040: as R222 on sheet 14 - mBUS-CAN; MCHP-ID: RSMT1040; Revision: 3; Symbol: Resistor; Status: MCL Design; ComponentLink1URL: https://chn-vm-apps.microchip.com/mchprepo/parts/Datasheets/PYu-RC0402_51_RoHS_L_6.pdf; ComponentLink1Description: SVN Datasheet; ComponentLink2URL: C:\ALTIUM_WORK\00001_MCHP-CDB\Datasheets\PYu-RC0402_51_RoHS_L_6.pdf; ComponentLink2Description: Local Datasheet; ComponentLink3URL: C:\ALTIUM_WORK\00001_MCHP-CDB\Library\LibraryRefs\Resistor.SchLib; ComponentLink3Description: Open Symbol; ComponentLink4URL: C:\ALTIUM_WORK\00001_MCHP-CDB\Library\Footprints\RES_C_0402.PcbLib; ComponentLink4Description: Open Footprint; ComponentLink5Description: Open Footprint 2; ComponentLink6Description: Open Footprint 3; ComponentLink7Description: Open Footprint 4; Operating Temperature: -55C to +155C; Category: Resistor; Type: RES SMD; Composition: TKF; Manufacturer 2: Stackpole Electronics Inc; Manufacturer Part Number 2: RMCF0402ZT0R00; Supplier 1: Digi-Key; Supplier Part Number 1: 311-0.0JRCT-ND; Supplier 2: Digi-Key; Supplier Part Number 2: RMCF0402ZT0R00TR-ND; Quantity Override: 1
R251 = RSMT1040: as R210-R215 on sheet 12 - MIPI-LVDS-RGB; MCHP-ID: RSMT1040; Revision: 3; Symbol: Resistor; Status: MCL Design; ComponentLink1URL: https://chn-vm-apps.microchip.com/mchprepo/parts/Datasheets/PYu-RC0402_51_RoHS_L_6.pdf; ComponentLink1Description: SVN Datasheet; ComponentLink2URL: C:\ALTIUM_WORK\00001_MCHP-CDB\Datasheets\PYu-RC0402_51_RoHS_L_6.pdf; ComponentLink2Description: Local Datasheet; ComponentLink3URL: C:\ALTIUM_WORK\00001_MCHP-CDB\Library\LibraryRefs\Resistor.SchLib; ComponentLink3Description: Open Symbol; ComponentLink4URL: C:\ALTIUM_WORK\00001_MCHP-CDB\Library\Footprints\RES_C_0402.PcbLib; ComponentLink4Description: Open Footprint; ComponentLink5Description: Open Footprint 2; ComponentLink6Description: Open Footprint 3; ComponentLink7Description: Open Footprint 4; Operating Temperature: -55C to +155C; Category: Resistor; Type: RES SMD; Composition: TKF; Manufacturer 2: Stackpole Electronics Inc; Manufacturer Part Number 2: RMCF0402ZT0R00; Supplier 1: Digi-Key; Supplier Part Number 1: 311-0.0JRCT-ND; Supplier 2: Digi-Key; Supplier Part Number 2: RMCF0402ZT0R00TR-ND; Quantity Override: 1
R252-R256 = RES1011: Manufacturer 1: Panasonic; Manufacturer Part Number 1: ERJ-2RKF1003X; Description_: RES TKF 100k 1% 1/10W SMD 0402; Dev Tools Status: Production; Voltage: 50V; Temperature Coeffcient: 100ppm/C; Power: 1/10W; Owner: Tad Ahlvers; Populated: YES; MCHP-ID: RES1011; Revision: 1; Symbol: Resistor; Status: MCL Design; ComponentLink1URL: https://chn-vm-apps.microchip.com/mchprepo/parts/Datasheets/AOA0000CE2.pdf; ComponentLink1Description: SVN Datasheet; ComponentLink2URL: C:\ALTIUM_WORK\00001_MCHP-CDB\Datasheets\AOA0000CE2.pdf; ComponentLink2Description: Local Datasheet; ComponentLink3URL: C:\ALTIUM_WORK\00001_MCHP-CDB\Library\LibraryRefs\Resistor.SchLib; ComponentLink3Description: Open Symbol; ComponentLink4URL: C:\ALTIUM_WORK\00001_MCHP-CDB\Library\Footprints\RES_C_0402.PcbLib; ComponentLink4Description: Open Footprint; ComponentLink5Description: Open Footprint 2; ComponentLink6Description: Open Footprint 3; ComponentLink7Description: Open Footprint 4; Operating Temperature: -55C to +125C; Category: Resistor; Type: RES SMD; Composition: TKF; Supplier 1: Digi-Key; Supplier Part Number 1: P100KLCT-ND; Quantity Override: 1
R257 R259 = RSMT1019: Manufacturer 1: Panasonic; Manufacturer Part Number 1: ERJ-2RKF1002X; Description_: RES TKF 10k 1% 1/10W SMD 0402; Dev Tools Status: Production; Voltage: 50V; Power: 1/10W; Owner: Brent Lanphear; Temperature Coefficient: 100ppm/C; MCHP-ID: RSMT1019; Revision: 2; Symbol: Resistor; Status: MCL Design; ComponentLink1URL: https://chn-vm-apps.microchip.com/mchprepo/parts/Datasheets/AOA0000CE2.pdf; ComponentLink1Description: SVN Datasheet; ComponentLink2URL: C:\ALTIUM_WORK\00001_MCHP-CDB\Datasheets\AOA0000CE2.pdf; ComponentLink2Description: Local Datasheet; ComponentLink3URL: C:\ALTIUM_WORK\00001_MCHP-CDB\Library\LibraryRefs\Resistor.SchLib; ComponentLink3Description: Open Symbol; ComponentLink4URL: C:\ALTIUM_WORK\00001_MCHP-CDB\Library\Footprints\RES_C_0402.PcbLib; ComponentLink4Description: Open Footprint; ComponentLink5Description: Open Footprint 2; ComponentLink6Description: Open Footprint 3; ComponentLink7Description: Open Footprint 4; Operating Temperature: -55C to +155C; Category: Resistor; Type: RES SMD; Composition: TKF; Supplier 1: Digi-Key; Supplier Part Number 1: P10.0KLCT-ND; Quantity Override: 1
SW1-SW4 = SWITCH1166: Switch; Manufacturer 1: C&K; Manufacturer Part Number 1: PTS 647 SK38 SMTR2 LFS; Description_: SWITCH TACT SPST 12V 50mA PTS 647 SK38 SMTR2 LFSSMD; Dev Tools Status: Design; Owner: Dragos Danaila; Voltage: 12V; Current: 50mA; Populated: YES; MCHP-ID: SWITCH1166; Revision: 1; Symbol: Switch 4 Pin; Status: MCL Design; ComponentLink1URL: https://chn-vm-apps.microchip.com/mchprepo/parts/Datasheets/pts647.pdf; ComponentLink1Description: SVN Datasheet; ComponentLink2URL: C:\ALTIUM_WORK\00001_MCHP-CDB\Datasheets\pts647.pdf; ComponentLink2Description: Local Datasheet; ComponentLink3URL: C:\ALTIUM_WORK\00001_MCHP-CDB\Library\LibraryRefs\Switch 4 Pin.SchLib; ComponentLink3Description: Open Symbol; ComponentLink4URL: C:\ALTIUM_WORK\00001_MCHP-CDB\Library\Footprints\SW_SMD_4.5mmX4.5mm_PTS647.PcbLib; ComponentLink4Description: Open Footprint; ComponentLink5Description: Open Footprint 2; ComponentLink6Description: Open Footprint 3; ComponentLink7Description: Open Footprint 4; Operating Temperature: -20C to +70C; Category: Switch; Type: Pushbutton; Supplier 1: Digikey; Supplier Part Number 1: PTS647SK38SMTR2LFSTR-ND; Quantity Override: 1
U19 = MIC0598: LDO; Manufacturer 1: Microchip Technology; Manufacturer Part Number 1: MCP1700T-3302E/TT; Description_: MCHP ANALOG LDO 3.3V MCP1700T-3302E/TT SOT-23-3; Dev Tools Status: Production; Populated: Yes; MCHP-ID: MIC0598; Symbol: MCP170X SOT-23-3_SOT-23A-3; Type: LDO; Status: MCL Design; Revision: 1; Category: MCHP-Analog; ComponentLink1URL: https://www.microchip.com/sitesearch/search/Product%20and%20Development%20Tools/MCP1700T-3302E/TT; ComponentLink1Description: SVN Datasheet; ComponentLink2Description: Local Datasheet; ComponentLink3URL: C:\ALTIUM_WORK\00001_MCHP-CDB\Library\LibraryRefs\MCP170X SOT-23-3_SOT-23A-3.SchLib; ComponentLink3Description: Open Symbol; ComponentLink4URL: C:\ALTIUM_WORK\00001_MCHP-CDB\Library\Footprints\SOT-23-3.PcbLib; ComponentLink4Description: Open Footprint; ComponentLink5Description: Open Footprint 2; ComponentLink6Description: Open Footprint 3; ComponentLink7Description: Open Footprint 4; Supplier 1: Microchip Technology; Supplier Part Number 1: MCP1700T-3302E/TT; Operating Temperature: -40C to +125C; Quantity Override: 1